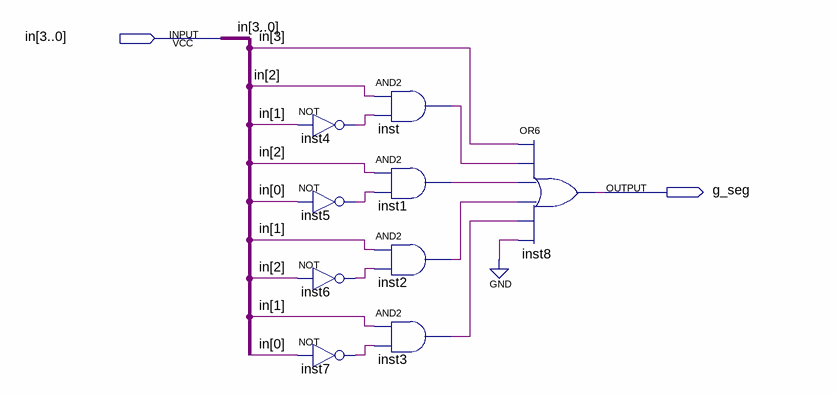
[diagram p0: schematic sheet]
// Quartus schematic g_seg.bdf as structural Verilog: 9 symbols, 2 pins
module g_seg (
  input  [3:0] in,
  output g_seg
);

  wire inst1_out, inst2_out, inst3_out, inst4_out, inst5_out, inst6_out, inst7_out, inst_out;

  not inst4 (inst4_out, in[1]);
  not inst5 (inst5_out, in[0]);
  not inst6 (inst6_out, in[2]);
  not inst7 (inst7_out, in[0]);
  and inst (inst_out, in[2], inst4_out);
  and inst1 (inst1_out, in[2], inst5_out);
  and inst2 (inst2_out, in[1], inst6_out);
  and inst3 (inst3_out, in[1], inst7_out);
  or inst8 (g_seg, in[3], inst_out, inst1_out, inst2_out, inst3_out, 1'b0);
endmodule
